# EAGLE schematic BusPirate-ultra.v1.0c (EAGLE 9.1.3)
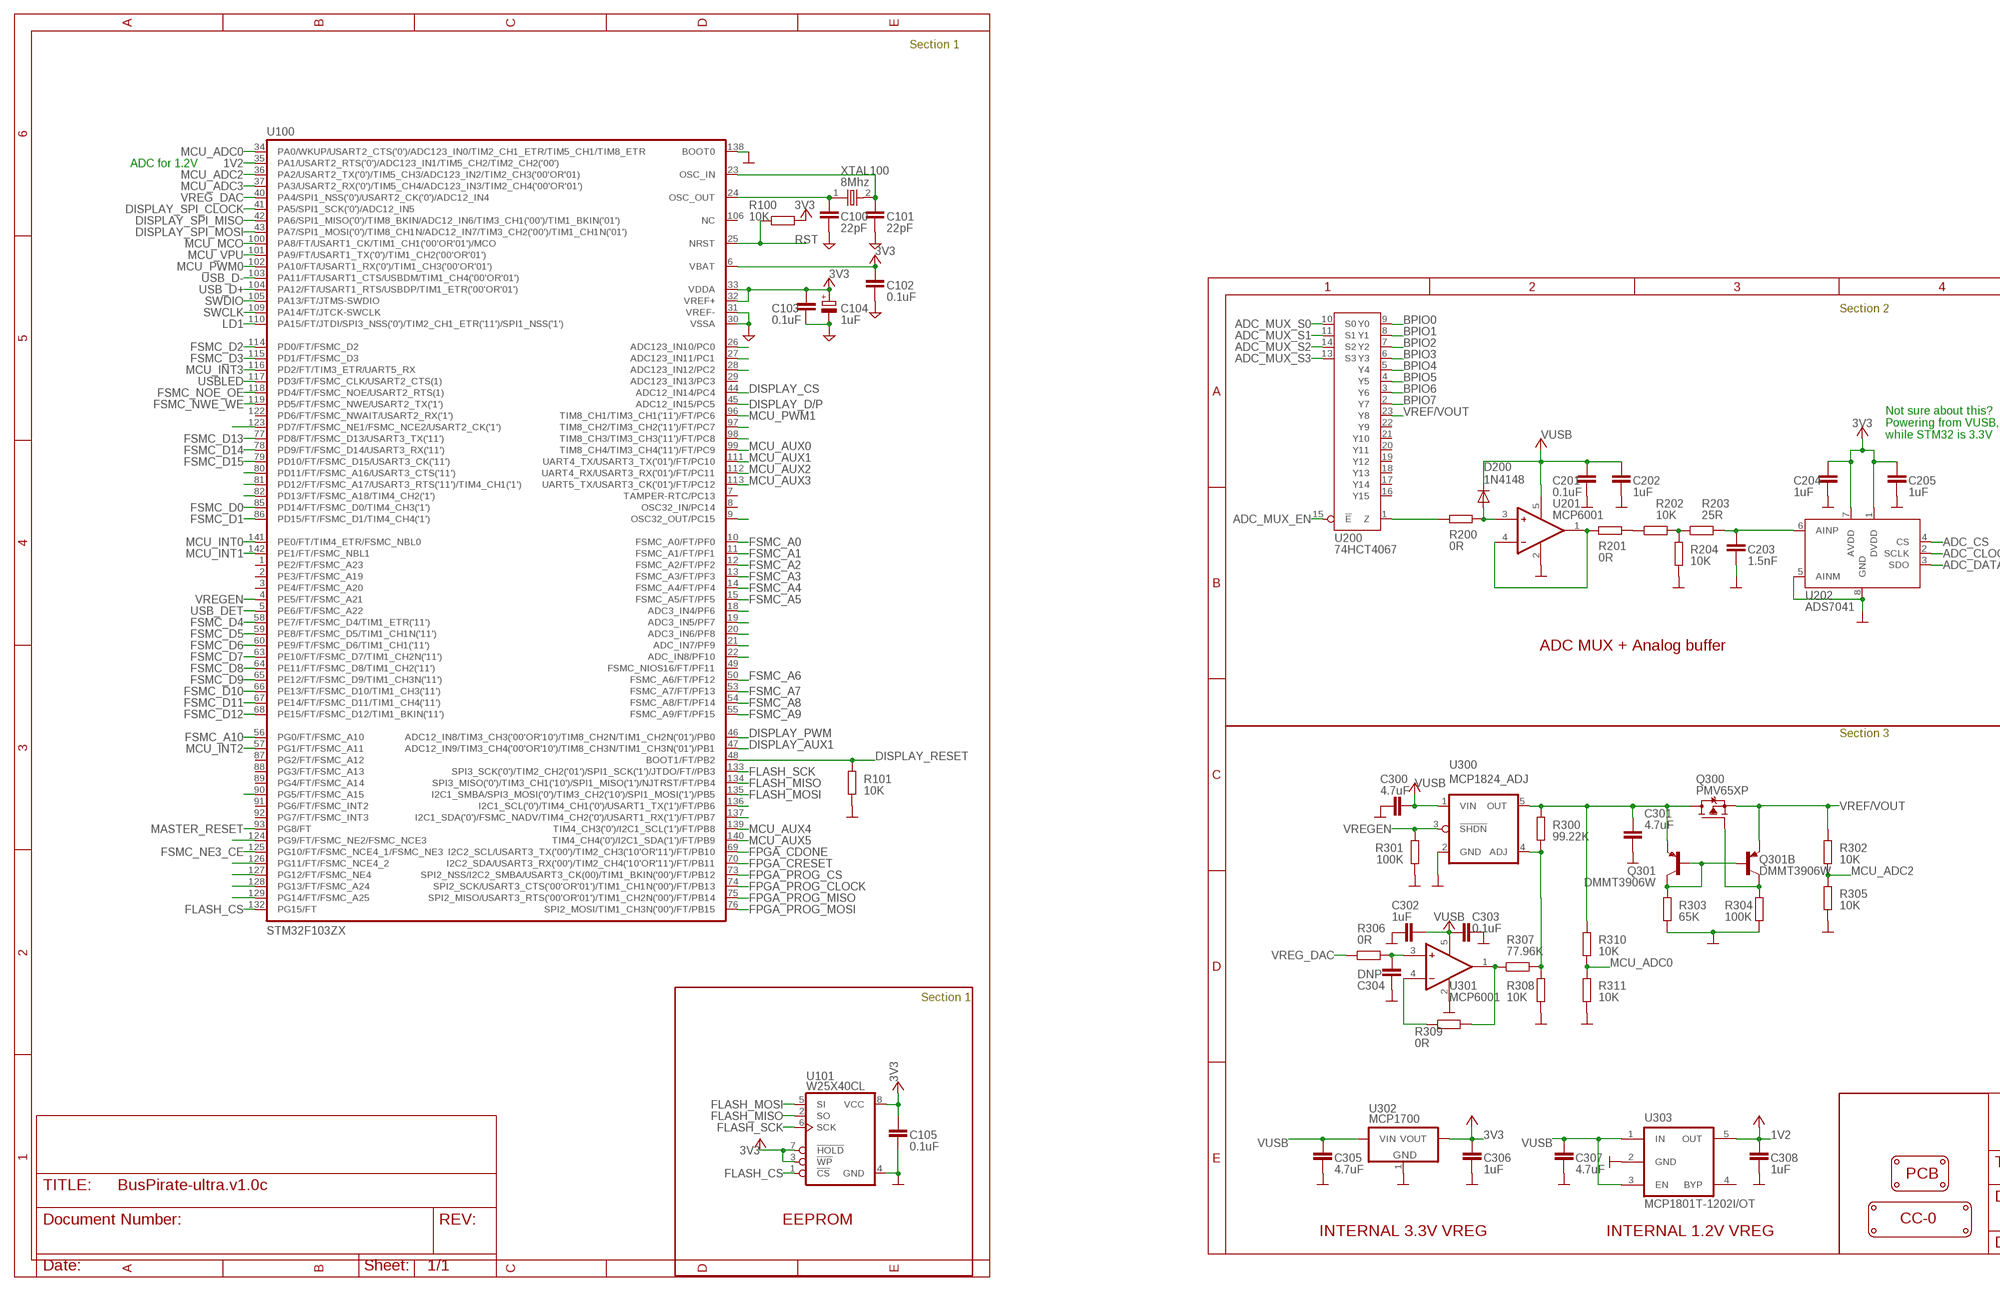
[diagram p0: schematic, sheet 1, part 1 of 3]
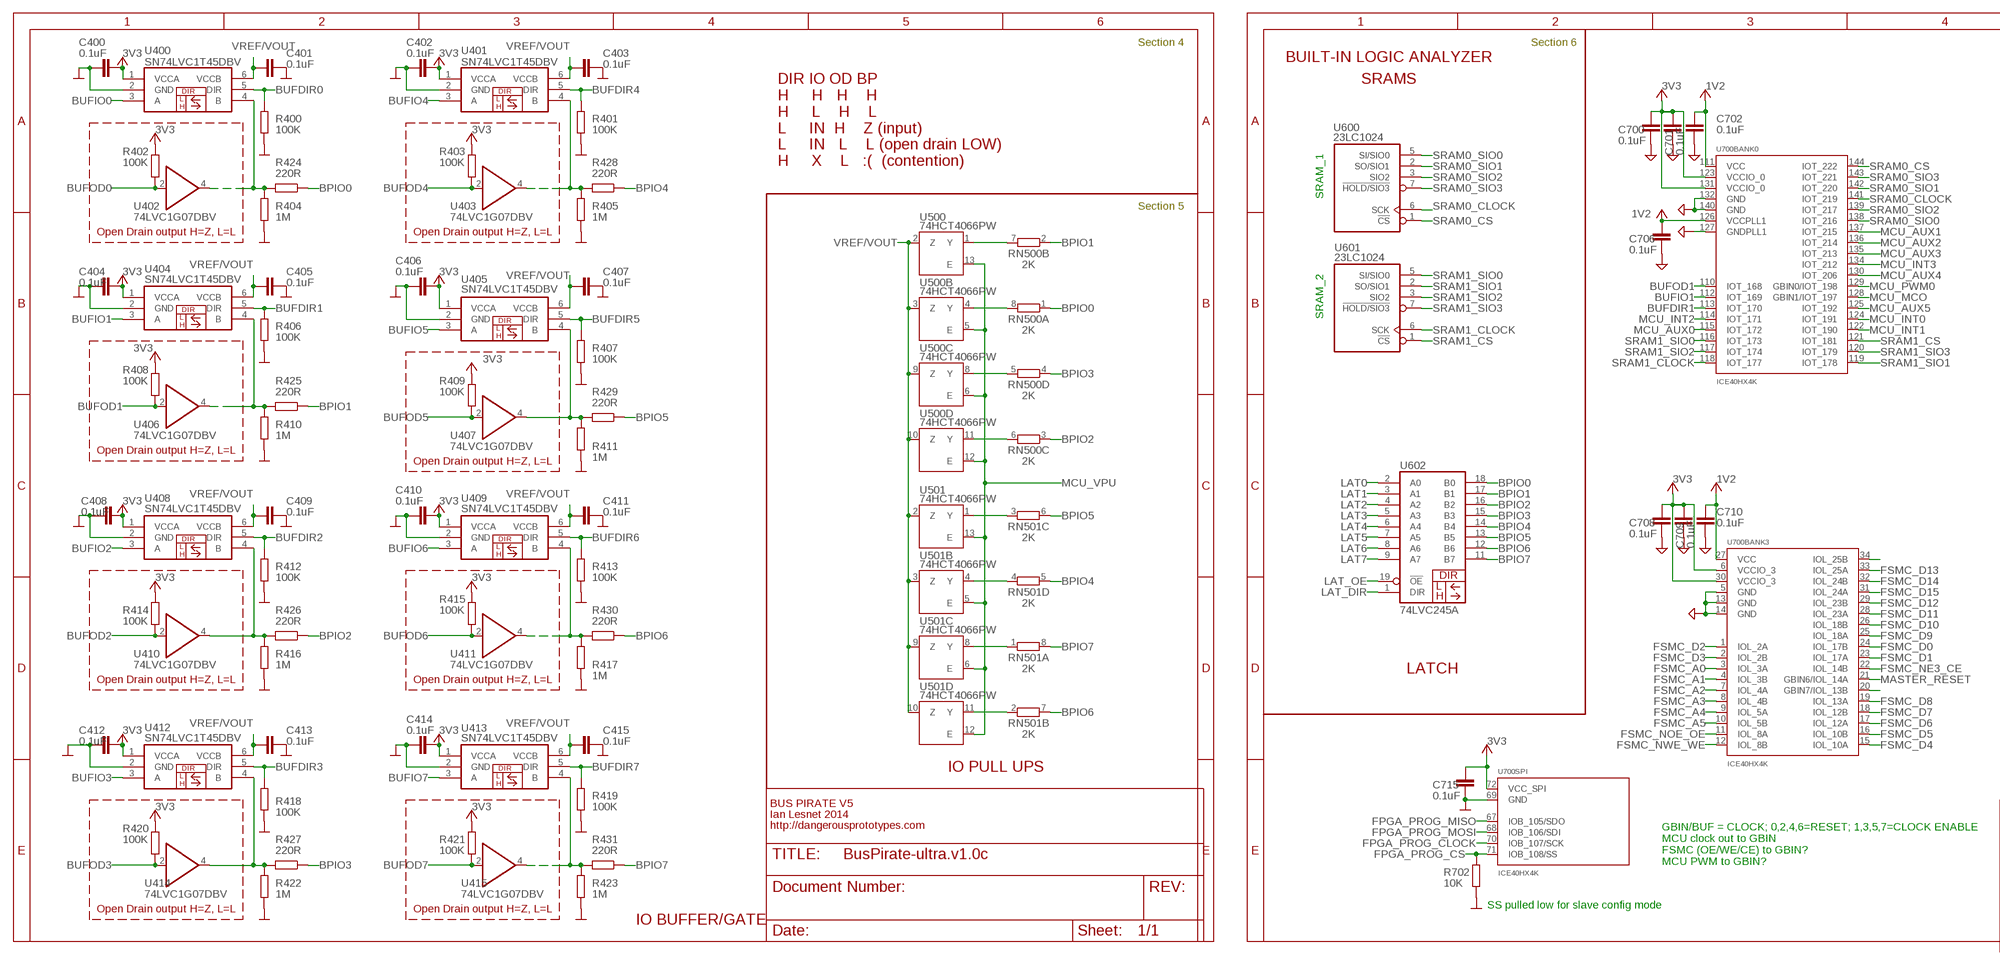
[diagram p1: schematic, sheet 1, part 2 of 3]
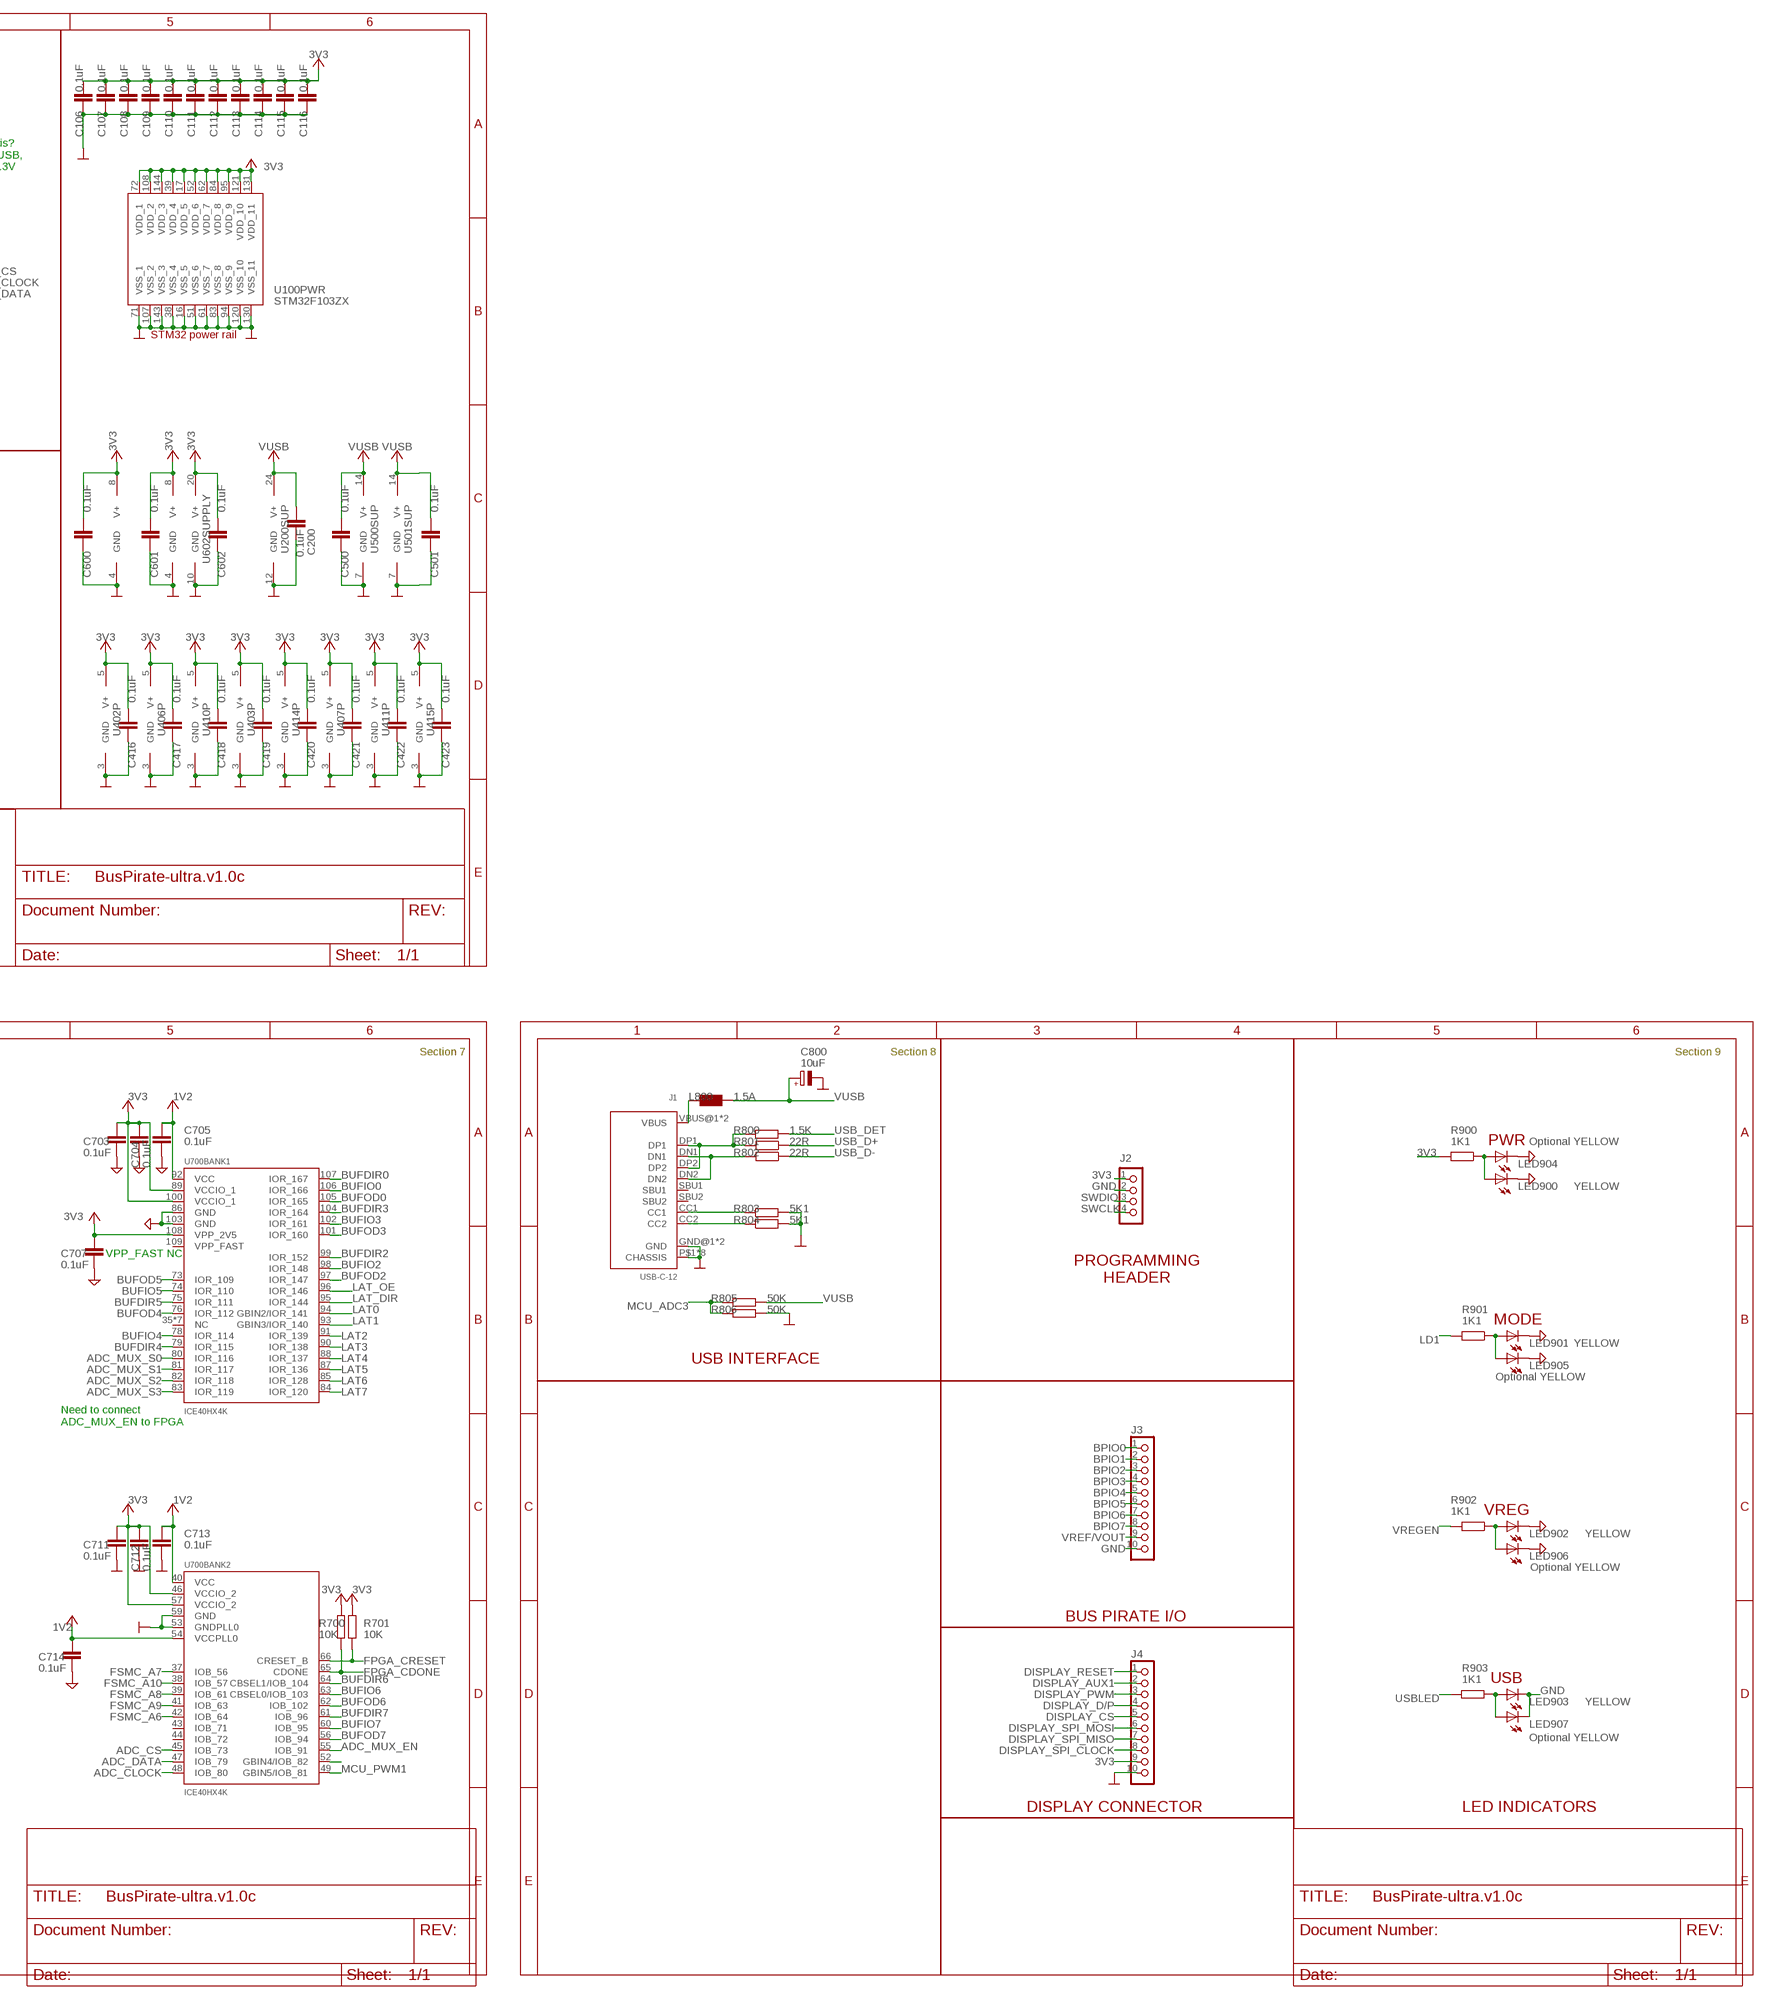
[diagram p2: schematic, sheet 1, part 3 of 3]

## Parts
C100  22pF  CAPACITOR_NPOL-0402  [C402]
C101  22pF  CAPACITOR_NPOL-0402  [C402]
C102  0.1uF  CAPACITOR_NPOL-0402  [C402]
C103  0.1uF  CAPACITOR_NPOL-0402  [C402]
C104  1uF  CAPACITOR_POL-SMC_A  [SMC_A]
C105  0.1uF  CAPACITOR_NPOL-0603  [C603]
C106  0.1uF  CAPACITOR_NPOL-0402  [C402]
C107  0.1uF  CAPACITOR_NPOL-0603  [C603]
C108  0.1uF  CAPACITOR_NPOL-0402  [C402]
C109  0.1uF  CAPACITOR_NPOL-0402  [C402]
C110  0.1uF  CAPACITOR_NPOL-0402  [C402]
C111  0.1uF  CAPACITOR_NPOL-0402  [C402]
C112  0.1uF  CAPACITOR_NPOL-0402  [C402]
C113  0.1uF  CAPACITOR_NPOL-0402  [C402]
C114  0.1uF  CAPACITOR_NPOL-0402  [C402]
C115  0.1uF  CAPACITOR_NPOL-0603  [C603]
C116  0.1uF  CAPACITOR_NPOL-0603  [C603]
C200  0.1uF  CAPACITOR_NPOL-0402  [C402]
C201  0.1uF  CAPACITOR_NPOL-0402  [C402]
C202  1uF  CAPACITOR_NPOL-0402  [C402]
C203  1.5nF  CAPACITOR_NPOL-0402  [C402]
C204  1uF  CAPACITOR_NPOL-0402  [C402]
C205  1uF  CAPACITOR_NPOL-0402  [C402]
C300  4.7uF  CAPACITOR_NPOL-0603  [C603]
C301  4.7uF  CAPACITOR_NPOL-0603  [C603]
C302  1uF  CAPACITOR_NPOL-0402  [C402]
C303  0.1uF  CAPACITOR_NPOL-0402  [C402]
C304  DNP  CAPACITOR_NPOL-0603  [C603]
C305  4.7uF  CAPACITOR_NPOL-0603  [C603]
C306  1uF  CAPACITOR_NPOL-0603  [C603]
C307  4.7uF  CAPACITOR_NPOL-0603  [C603]
C308  1uF  CAPACITOR_NPOL-0402  [C402]
C400  0.1uF  CAPACITOR_NPOL-0402  [C402]
C401  0.1uF  CAPACITOR_NPOL-0402  [C402]
C402  0.1uF  CAPACITOR_NPOL-0402  [C402]
C403  0.1uF  CAPACITOR_NPOL-0402  [C402]
C404  0.1uF  CAPACITOR_NPOL-0402  [C402]
C405  0.1uF  CAPACITOR_NPOL-0402  [C402]
C406  0.1uF  CAPACITOR_NPOL-0402  [C402]
C407  0.1uF  CAPACITOR_NPOL-0402  [C402]
C408  0.1uF  CAPACITOR_NPOL-0402  [C402]
C409  0.1uF  CAPACITOR_NPOL-0402  [C402]
C410  0.1uF  CAPACITOR_NPOL-0402  [C402]
C411  0.1uF  CAPACITOR_NPOL-0402  [C402]
C412  0.1uF  CAPACITOR_NPOL-0402  [C402]
C413  0.1uF  CAPACITOR_NPOL-0402  [C402]
C414  0.1uF  CAPACITOR_NPOL-0402  [C402]
C415  0.1uF  CAPACITOR_NPOL-0402  [C402]
C416  0.1uF  CAPACITOR_NPOL-0402  [C402]
C417  0.1uF  CAPACITOR_NPOL-0402  [C402]
C418  0.1uF  CAPACITOR_NPOL-0402  [C402]
C419  0.1uF  CAPACITOR_NPOL-0402  [C402]
C420  0.1uF  CAPACITOR_NPOL-0402  [C402]
C421  0.1uF  CAPACITOR_NPOL-0402  [C402]
C422  0.1uF  CAPACITOR_NPOL-0402  [C402]
C423  0.1uF  CAPACITOR_NPOL-0402  [C402]
C500  0.1uF  CAPACITOR_NPOL-0603  [C603]
C501  0.1uF  CAPACITOR_NPOL-0402  [C402]
C600  0.1uF  CAPACITOR_NPOL-0603  [C603]
C601  0.1uF  CAPACITOR_NPOL-0603  [C603]
C602  0.1uF  CAPACITOR_NPOL-0402  [C402]
C700  0.1uF  CAPACITOR_NPOL-0603  [C603]
C701  0.1uF  CAPACITOR_NPOL-0603  [C603]
C702  0.1uF  CAPACITOR_NPOL-0402  [C402]
C703  0.1uF  CAPACITOR_NPOL-0402  [C402]
C704  0.1uF  CAPACITOR_NPOL-0402  [C402]
C705  0.1uF  CAPACITOR_NPOL-0402  [C402]
C706  0.1uF  CAPACITOR_NPOL-0603  [C603]
C707  0.1uF  CAPACITOR_NPOL-0402  [C402]
C708  0.1uF  CAPACITOR_NPOL-0402  [C402]
C709  0.1uF  CAPACITOR_NPOL-0402  [C402]
C710  0.1uF  CAPACITOR_NPOL-0402  [C402]
C711  0.1uF  CAPACITOR_NPOL-0402  [C402]
C712  0.1uF  CAPACITOR_NPOL-0402  [C402]
C713  0.1uF  CAPACITOR_NPOL-0402  [C402]
C714  0.1uF  CAPACITOR_NPOL-0402  [C402]
C715  0.1uF  CAPACITOR_NPOL-0402  [C402]
C800  10uF  CAPACITOR_POL-SMC_A  [SMC_A]
D200  1N4148  DIODE-SOD-123  [SOD-123]
J1  USB-C-12  [C-31-M-12]
J2  CON_HEADER_1X04  [M1X4]
J3  CON_HEADER_1X10-RIGHT_ANGLED_PTH_SHROUDED  [M1X10_MALE_RIGHT_ANGLES_PTH_SHROUDED]
J4  CON-FPC_X05B20L10T  [X05B20L10T]
L800  1.5A  WE-KIL_0805  [WE-KI_0805_B]
LED900  YELLOW  LED-0805  [LED-805]
LED901  YELLOW  LED-0805  [LED-805]
LED902  YELLOW  LED-0805  [LED-805]
LED903  YELLOW  LED-0805  [LED-805]
LED904  Optional YELLOW  LED-0805  [LED-805]
LED905  Optional YELLOW  LED-0805  [LED-805]
LED906  Optional YELLOW  LED-0805  [LED-805]
LED907  Optional YELLOW  LED-0805  [LED-805]
LOGO1  LOGO_CC-0  [LOGO_CC-0]
PCB1  PCB_DP_RECTANGLE-50X100  [DP10050_V1]
Q300  PMV65XP  TRANSISTOR_FET_TSM2301CX  [SOT-23]
Q301  DMMT3906W  TRANSISTOR-BJT_DMMT3906W  [SOT-363]
R100  10K  RESISTOR-0402  [R402]
R101  10K  RESISTOR-0402  [R402]
R200  0R  RESISTOR-0402  [R402]
R201  0R  RESISTOR-0402  [R402]
R202  10K  RESISTOR-0402  [R402]
R203  25R  RESISTOR-0402  [R402]
R204  10K  RESISTOR-0402  [R402]
R300  99.22K  RESISTOR-0402  [R402]
R301  100K  RESISTOR-0402  [R402]
R302  10K  RESISTOR-0603  [R603]
R303  65K  RESISTOR-0603  [R603]
R304  100K  RESISTOR-0603  [R603]
R305  10K  RESISTOR-0603  [R603]
R306  0R  RESISTOR-0603  [R603]
R307  77.96K  RESISTOR-0402  [R402]
R308  10K  RESISTOR-0402  [R402]
R309  0R  RESISTOR-0402  [R402]
R310  10K  RESISTOR-0402  [R402]
R311  10K  RESISTOR-0402  [R402]
R400  100K  RESISTOR-0402  [R402]
R401  100K  RESISTOR-0402  [R402]
R402  100K  RESISTOR-0402  [R402]
R403  100K  RESISTOR-0402  [R402]
R404  1M  RESISTOR-0402  [R402]
R405  1M  RESISTOR-0402  [R402]
R406  100K  RESISTOR-0402  [R402]
R407  100K  RESISTOR-0402  [R402]
R408  100K  RESISTOR-0402  [R402]
R409  100K  RESISTOR-0402  [R402]
R410  1M  RESISTOR-0402  [R402]
R411  1M  RESISTOR-0402  [R402]
R412  100K  RESISTOR-0402  [R402]
R413  100K  RESISTOR-0402  [R402]
R414  100K  RESISTOR-0402  [R402]
R415  100K  RESISTOR-0402  [R402]
R416  1M  RESISTOR-0402  [R402]
R417  1M  RESISTOR-0402  [R402]
R418  100K  RESISTOR-0402  [R402]
R419  100K  RESISTOR-0402  [R402]
R420  100K  RESISTOR-0402  [R402]
R421  100K  RESISTOR-0402  [R402]
R422  1M  RESISTOR-0402  [R402]
R423  1M  RESISTOR-0402  [R402]
R424  220R  RESISTOR-0402  [R402]
R425  220R  RESISTOR-0402  [R402]
R426  220R  RESISTOR-0402  [R402]
R427  220R  RESISTOR-0402  [R402]
R428  220R  RESISTOR-0402  [R402]
R429  220R  RESISTOR-0402  [R402]
R430  220R  RESISTOR-0402  [R402]
R431  220R  RESISTOR-0402  [R402]
R700  10K  RESISTOR-0402  [R402]
R701  10K  RESISTOR-0402  [R402]
R702  10K  RESISTOR-0402  [R402]
R800  1.5K  RESISTOR-0402  [R402]
R801  22R  RESISTOR-0402  [R402]
R802  22R  RESISTOR-0402  [R402]
R803  5K1  RESISTOR-0402  [R402]
R804  5K1  RESISTOR-0402  [R402]
R805  50K  RESISTOR-0402  [R402]
R806  50K  RESISTOR-0402  [R402]
R900  1K1  RESISTOR-0603  [R603]
R901  1K1  RESISTOR-0603  [R603]
R902  1K1  RESISTOR-0603  [R603]
R903  1K1  RESISTOR-0603  [R603]
RN500  2K  RNETWORK  [RN8P-4R-CRA06S]
RN501  2K  RNETWORK  [RN8P-4R-CRA06S]
U100  STM32F103ZX  IC_UC_STM32F103ZX  [TQFP-144]
U101  W25X40CL  IC_MEM_W25X40CL  [SOIC-8]
U200  74HCT4067  IC_74HCT4067  [TSSOP-24]
U201  MCP6001  IC_OP-AMP_MCP6001  [SOT-23-5]
U202  ADS7041  IC_ADC_ADS7041  [VSSOP-8_DCU_PDSO_G8]
U300  MCP1824_ADJ  IC_MCP1824_ADJ  [SOT-23-5]
U301  MCP6001  IC_OP-AMP_MCP6001  [SOT-23-5]
U302  MCP1700  IC_MCP1700  [SOT-89]
U303  MCP1801T-1202I/OT  MIC5205  [SOT-23-5@1]
U400  SN74LVC1T45DBV  IC_BUFF_SN74LVC1T45DBV-SC-70-6  [SC-70-6]
U401  SN74LVC1T45DBV  IC_BUFF_SN74LVC1T45DBV-SC-70-6  [SC-70-6]
U402  74LVC1G07DBV  IC_BUFF_74LVC1G07  [SC-70-5]
U403  74LVC1G07DBV  IC_BUFF_74LVC1G07  [SC-70-5]
U404  SN74LVC1T45DBV  IC_BUFF_SN74LVC1T45DBV-SC-70-6  [SC-70-6]
U405  SN74LVC1T45DBV  IC_BUFF_SN74LVC1T45DBV-SC-70-6  [SC-70-6]
U406  74LVC1G07DBV  IC_BUFF_74LVC1G07  [SC-70-5]
U407  74LVC1G07DBV  IC_BUFF_74LVC1G07  [SC-70-5]
U408  SN74LVC1T45DBV  IC_BUFF_SN74LVC1T45DBV-SC-70-6  [SC-70-6]
U409  SN74LVC1T45DBV  IC_BUFF_SN74LVC1T45DBV-SC-70-6  [SC-70-6]
U410  74LVC1G07DBV  IC_BUFF_74LVC1G07  [SC-70-5]
U411  74LVC1G07DBV  IC_BUFF_74LVC1G07  [SC-70-5]
U412  SN74LVC1T45DBV  IC_BUFF_SN74LVC1T45DBV-SC-70-6  [SC-70-6]
U413  SN74LVC1T45DBV  IC_BUFF_SN74LVC1T45DBV-SC-70-6  [SC-70-6]
U414  74LVC1G07DBV  IC_BUFF_74LVC1G07  [SC-70-5]
U415  74LVC1G07DBV  IC_BUFF_74LVC1G07  [SC-70-5]
U500  74HCT4066PW  IC_74HCT4066PW  [TSSOP-14]
U501  74HCT4066PW  IC_74HCT4066PW  [TSSOP-14]
U600  23LC1024  IC_MEM_23LC1024  [SOIC-8]
U601  23LC1024  IC_MEM_23LC1024  [SOIC-8]
U602  74LVC245A  IC_BUFF_74LVC245A-TSSOP20  [TSSOP-20]
U700  ICE40HX4K  IC_FPGA_ICE40HX4K  [TQFP-144]
XTAL100  8Mhz  OSC-XTAL-12M  [XTAL_4X6]

## Nets
1V2 [power]: C308.2 C702.1 C705.1 C706.1 C710.1 C713.1 C714.1 U100.35(PA1/USART2_RTS('0')/ADC123_IN1/TIM5_CH2/TIM2_CH2('00')) U303.5(OUT) U700.27(BANK3:VCC) U700.40(BANK2:VCC) U700.54(BANK2:VCCPLL0) U700.92(BANK1:VCC) U700.111(BANK0:VCC) U700.126(BANK0:VCCPLL1) ; supply symbol labelled SUPPLY_+3V3
3V3 [power]: C102.1 C103.1 C104.+ C105.1 C106.1 C107.1 C108.1 C109.1 C110.1 C111.1 C112.1 C113.1 C114.1 C115.1 C116.1 C204.1 C205.1 C306.2 C400.2 C402.2 C404.2 C406.2 C408.2 C410.2 C412.2 C414.2 C416.2 C417.2 C418.2 C419.2 C420.2 C421.2 C422.2 C423.2 C600.2 C601.2 C602.2 C700.1 C701.1 C703.1 C704.1 C707.1 C708.1 C709.1 C711.1 C712.1 C715.1 J2.1 J4.9 R100.2 R402.2 R403.2 R408.2 R409.2 R414.2 R415.2 R420.2 R421.2 R700.2 R701.2 R900.2 U100.6(VBAT) U100.17(VDD_5) U100.32(VREF+) U100.33(VDDA) U100.39(VDD_4) U100.52(VDD_6) U100.62(VDD_7) U100.72(VDD_1) U100.84(VDD_8) U100.95(VDD_9) U100.108(VDD_2) U100.121(VDD_10) U100.131(VDD_11) U100.144(VDD_3) U101.3(!WP) U101.7(!HOLD) U101.8(VCC) U202.1(DVDD) U202.7(AVDD) U302.3(VOUT) U400.1(VCCA) U401.1(VCCA) U402.5(V+) U403.5(V+) U404.1(VCCA) U405.1(VCCA) U406.5(V+) U407.5(V+) U408.1(VCCA) U409.1(VCCA) U410.5(V+) U411.5(V+) U412.1(VCCA) U413.1(VCCA) U414.5(V+) U415.5(V+) U600.8(V+) U601.8(V+) U602.20(V+) U700.6(BANK3:VCCIO_3) U700.30(BANK3:VCCIO_3) U700.46(BANK2:VCCIO_2) U700.57(BANK2:VCCIO_2) U700.72(SPI:VCC_SPI) U700.89(BANK1:VCCIO_1) U700.100(BANK1:VCCIO_1) U700.108(BANK1:VPP_2V5) U700.123(BANK0:VCCIO_0) U700.131(BANK0:VCCIO_0) ; supply symbol labelled V+, SUPPLY_+3V3, VCC
ADC_CLOCK: U202.2(SCLK) U700.48(BANK2:IOB_80)
ADC_CS: U202.4(CS) U700.45(BANK2:IOB_73)
ADC_DATA: U202.3(SDO) U700.47(BANK2:IOB_79)
ADC_MUX_EN: U200.15(!E) U700.55(BANK2:IOB_91)
ADC_MUX_S0 [signal_digital]: U200.10(S0) U700.80(BANK1:IOR_116)
ADC_MUX_S1 [signal_digital]: U200.11(S1) U700.81(BANK1:IOR_117)
ADC_MUX_S2: U200.14(S2) U700.82(BANK1:IOR_118)
ADC_MUX_S3: U200.13(S3) U700.83(BANK1:IOR_119)
BPIO0: J3.1 R424.1 RN500.1 U200.9(Y0) U602.18(B0)
BPIO0I: R404.2 R424.2 U400.4(B) U402.4(O)
BPIO1: J3.2 R425.1 RN500.2 U200.8(Y1) U602.17(B1)
BPIO1I: R410.2 R425.2 U404.4(B) U406.4(O)
BPIO2: J3.3 R426.1 RN500.3 U200.7(Y2) U602.16(B2)
BPIO2I: R416.2 R426.2 U408.4(B) U410.4(O)
BPIO3: J3.4 R427.1 RN500.4 U200.6(Y3) U602.15(B3)
BPIO3I: R422.2 R427.2 U412.4(B) U414.4(O)
BPIO4: J3.5 R428.1 RN501.5 U200.5(Y4) U602.14(B4)
BPIO4I: R405.2 R428.2 U401.4(B) U403.4(O)
BPIO5 [signal_mixed]: J3.6 R429.1 RN501.6 U200.4(Y5) U602.13(B5)
BPIO5I: R411.2 R429.2 U405.4(B) U407.4(O)
BPIO6 [signal_mixed]: J3.7 R430.1 RN501.7 U200.3(Y6) U602.12(B6)
BPIO6I [signal_mixed]: R417.2 R430.2 U409.4(B) U411.4(O)
BPIO7 [signal_mixed]: J3.8 R431.1 RN501.8 U200.2(Y7) U602.11(B7)
BPIO7I: R423.2 R431.2 U413.4(B) U415.4(O)
BUFDIR0: R400.2 U400.5(DIR) U700.107(BANK1:IOR_167)
BUFDIR1: R406.2 U404.5(DIR) U700.113(BANK0:IOT_170)
BUFDIR2 [signal_digital]: R412.2 U408.5(DIR) U700.99(BANK1:IOR_152)
BUFDIR3: R418.2 U412.5(DIR) U700.104(BANK1:IOR_164)
BUFDIR4 [signal_digital]: R401.2 U401.5(DIR) U700.79(BANK1:IOR_115)
BUFDIR5: R407.2 U405.5(DIR) U700.75(BANK1:IOR_111)
BUFDIR6 [signal_digital]: R413.2 U409.5(DIR) U700.64(BANK2:CBSEL1/IOB_104)
BUFDIR7 [signal_digital]: R419.2 U413.5(DIR) U700.61(BANK2:IOB_96)
BUFIO0: U400.3(A) U700.106(BANK1:IOR_166)
BUFIO1: U404.3(A) U700.112(BANK0:IOT_169)
BUFIO2: U408.3(A) U700.98(BANK1:IOR_148)
BUFIO3: U412.3(A) U700.102(BANK1:IOR_161)
BUFIO4: U401.3(A) U700.78(BANK1:IOR_114)
BUFIO5: U405.3(A) U700.74(BANK1:IOR_110)
BUFIO6 [signal_mixed]: U409.3(A) U700.63(BANK2:CBSEL0/IOB_103)
BUFIO7: U413.3(A) U700.60(BANK2:IOB_95)
BUFOD0: R402.1 U402.2(I) U700.105(BANK1:IOR_165)
BUFOD1: R408.1 U406.2(I) U700.110(BANK0:IOT_168)
BUFOD2: R414.1 U410.2(I) U700.97(BANK1:IOR_147)
BUFOD3: R420.1 U414.2(I) U700.101(BANK1:IOR_160)
BUFOD4: R403.1 U403.2(I) U700.76(BANK1:IOR_112)
BUFOD5: R409.1 U407.2(I) U700.73(BANK1:IOR_109)
BUFOD6 [signal_mixed]: R415.1 U411.2(I) U700.62(BANK2:IOB_102)
BUFOD7: R421.1 U415.2(I) U700.56(BANK2:IOB_94)
D+ [signal_digital]: J1.DP1 J1.DP2 R800.1 R801.2
D- [signal_digital]: J1.DN1 J1.DN2 R802.2
DISPLAY_AUX1 [signal_digital]: J4.2 U100.47(ADC12_IN9/TIM3_CH4('00'OR'10')/TIM8_CH3N/TIM1_CH3N('01')/PB1)
DISPLAY_CS [signal_digital]: J4.5 U100.44(ADC12_IN14/PC4)
DISPLAY_D/P [signal_digital]: J4.4 U100.45(ADC12_IN15/PC5)
DISPLAY_PWM [signal_digital]: J4.3 U100.46(ADC12_IN8/TIM3_CH3('00'OR'10')/TIM8_CH2N/TIM1_CH2N('01')/PB0)
DISPLAY_RESET [signal_digital]: J4.1 R101.2 U100.48(BOOT1/FT/PB2)
DISPLAY_SPI_CLOCK [signal_digital]: J4.8 U100.41(PA5/SPI1_SCK('0')/ADC12_IN5)
DISPLAY_SPI_MISO [signal_digital]: J4.7 U100.42(PA6/SPI1_MISO('0')/TIM8_BKIN/ADC12_IN6/TIM3_CH1('00')/TIM1_BKIN('01'))
DISPLAY_SPI_MOSI [signal_digital]: J4.6 U100.43(PA7/SPI1_MOSI('0')/TIM8_CH1N/ADC12_IN7/TIM3_CH2('00')/TIM1_CH1N('01'))
FLASH_CS: U100.132(PG15/FT) U101.1(!CS)
FLASH_MISO: U100.134(SPI3_MISO('0')/TIM3_CH1('10')/SPI1_MISO('1')/NJTRST/FT/PB4) U101.2(SO)
FLASH_MOSI: U100.135(I2C1_SMBA/SPI3_MOSI('0')/TIM3_CH2('10')/SPI1_MOSI('1')/PB5) U101.5(SI)
FLASH_SCK: U100.133(SPI3_SCK('0')/TIM2_CH2('01')/SPI1_SCK('1')/JTDO/FT//PB3) U101.6(SCK)
FPGA_CDONE: R700.1 U100.69(I2C2_SCL/USART3_TX('00')/TIM2_CH3('10'OR'11')/FT/PB10) U700.65(BANK2:CDONE)
FPGA_CRESET: R701.1 U100.70(I2C2_SDA/USART3_RX('00')/TIM2_CH4('10'OR'11')/FT/PB11) U700.66(BANK2:CRESET_B)
FPGA_PROG_CLOCK: U100.74(SPI2_SCK/USART3_CTS('00'OR'01')/TIM1_CH1N('00')/FT/PB13) U700.70(SPI:IOB_107/SCK)
FPGA_PROG_CS: R702.2 U100.73(SPI2_NSS/I2C2_SMBA/USART3_CK(00)/TIM1_BKIN('00')/FT/PB12) U700.71(SPI:IOB_108/SS)
FPGA_PROG_MISO: U100.75(SPI2_MISO/USART3_RTS('00'OR'01')/TIM1_CH2N('00')/FT/PB14) U700.67(SPI:IOB_105/SDO)
FPGA_PROG_MOSI: U100.76(SPI2_MOSI/TIM1_CH3N('00')/FT/PB15) U700.68(SPI:IOB_106/SDI)
FSMC_A0: U100.10(FSMC_A0/FT/PF0) U700.3(BANK3:IOL_3A)
FSMC_A1: U100.11(FSMC_A1/FT/PF1) U700.4(BANK3:IOL_3B)
FSMC_A2: U100.12(FSMC_A2/FT/PF2) U700.7(BANK3:IOL_4A)
FSMC_A3: U100.13(FSMC_A3/FT/PF3) U700.8(BANK3:IOL_4B)
FSMC_A4: U100.14(FSMC_A4/FT/PF4) U700.9(BANK3:IOL_5A)
FSMC_A5: U100.15(FSMC_A5/FT/PF5) U700.10(BANK3:IOL_5B)
FSMC_A6 [signal_digital]: U100.50(FSMC_A6/FT/PF12) U700.42(BANK2:IOB_64)
FSMC_A7: U100.53(FSMC_A7/FT/PF13) U700.37(BANK2:IOB_56)
FSMC_A8: U100.54(FSMC_A8/FT/PF14) U700.39(BANK2:IOB_61)
FSMC_A9: U100.55(FSMC_A9/FT/PF15) U700.41(BANK2:IOB_63)
FSMC_A10 [signal_digital]: U100.56(PG0/FT/FSMC_A10) U700.38(BANK2:IOB_57)
FSMC_D0: U100.85(PD14/FT/FSMC_D0/TIM4_CH3('1')) U700.24(BANK3:IOL_17B)
FSMC_D1: U100.86(PD15/FT/FSMC_D1/TIM4_CH4('1')) U700.23(BANK3:IOL_17A)
FSMC_D2: U100.114(PD0/FT/FSMC_D2) U700.1(BANK3:IOL_2A)
FSMC_D3: U100.115(PD1/FT/FSMC_D3) U700.2(BANK3:IOL_2B)
FSMC_D4: U100.58(PE7/FT/FSMC_D4/TIM1_ETR('11')) U700.15(BANK3:IOL_10A)
FSMC_D5: U100.59(PE8/FT/FSMC_D5/TIM1_CH1N('11')) U700.16(BANK3:IOL_10B)
FSMC_D6: U100.60(PE9/FT/FSMC_D6/TIM1_CH1('11')) U700.17(BANK3:IOL_12A)
FSMC_D7: U100.63(PE10/FT/FSMC_D7/TIM1_CH2N('11')) U700.18(BANK3:IOL_12B)
FSMC_D8: U100.64(PE11/FT/FSMC_D8/TIM1_CH2('11')) U700.19(BANK3:IOL_13A)
FSMC_D9: U100.65(PE12/FT/FSMC_D9/TIM1_CH3N('11')) U700.25(BANK3:IOL_18A)
FSMC_D10: U100.66(PE13/FT/FSMC_D10/TIM1_CH3('11')) U700.26(BANK3:IOL_18B)
FSMC_D11: U100.67(PE14/FT/FSMC_D11/TIM1_CH4('11')) U700.28(BANK3:IOL_23A)
FSMC_D12: U100.68(PE15/FT/FSMC_D12/TIM1_BKIN('11')) U700.29(BANK3:IOL_23B)
FSMC_D13: U100.77(PD8/FT/FSMC_D13/USART3_TX('11')) U700.33(BANK3:IOL_25A)
FSMC_D14: U100.78(PD9/FT/FSMC_D14/USART3_RX('11')) U700.32(BANK3:IOL_24B)
FSMC_D15: U100.79(PD10/FT/FSMC_D15/USART3_CK('11')) U700.31(BANK3:IOL_24A)
FSMC_NE3_CE: U100.125(PG10/FT/FSMC_NCE4_1/FSMC_NE3) U700.22(BANK3:IOL_14B)
FSMC_NOE_OE: U100.118(PD4/FT/FSMC_NOE/USART2_RTS(1)) U700.11(BANK3:IOL_8A)
FSMC_NWE_WE: U100.119(PD5/FT/FSMC_NWE/USART2_TX('1')) U700.12(BANK3:IOL_8B)
GND: C100.2 C101.2 C102.2 C103.2 C104.- C105.2 C106.2 C107.2 C108.2 C109.2 C110.2 C111.2 C112.2 C113.2 C114.2 C115.2 C116.2 C200.1 C201.2 C202.2 C203.2 C204.2 C205.2 C300.2 C301.2 C302.1 C303.1 C304.1 C305.1 C306.1 C307.1 C308.1 C400.1 C401.2 C402.1 C403.2 C404.1 C405.2 C406.1 C407.2 C408.1 C409.2 C410.1 C411.2 C412.1 C413.2 C414.1 C415.2 C416.1 C417.1 C418.1 C419.1 C420.1 C421.1 C422.1 C423.1 C500.1 C501.1 C600.1 C601.1 C602.1 C700.2 C701.2 C702.2 C703.2 C704.2 C705.2 C706.2 C707.2 C708.2 C709.2 C710.2 C711.2 C712.2 C713.2 C714.2 C715.2 C800.- J1.GND@1(GND) J1.GND@2(GND) J1.P$1(CHASSIS) J1.P$2(CHASSIS) J1.P$3(CHASSIS) J1.P$4(CHASSIS) J1.P$5(CHASSIS) J1.P$6(CHASSIS) J1.P$7(CHASSIS) J1.P$8(CHASSIS) J2.2 J3.10 J4.10 LED900.C LED901.C LED902.C LED903.C LED904.C LED905.C LED906.C LED907.C R101.1 R204.2 R301.2 R303.1 R304.1 R305.2 R308.2 R311.2 R400.1 R401.1 R404.1 R405.1 R406.1 R407.1 R410.1 R411.1 R412.1 R413.1 R416.1 R417.1 R418.1 R419.1 R422.1 R423.1 R702.1 R803.2 R804.2 R806.1 U100.16(VSS_5) U100.30(VSSA) U100.31(VREF-) U100.38(VSS_4) U100.51(VSS_6) U100.61(VSS_7) U100.71(VSS_1) U100.83(VSS_8) U100.94(VSS_9) U100.107(VSS_2) U100.120(VSS_10) U100.130(VSS_11) U100.138(BOOT0) U100.143(VSS_3) U101.4(GND) U200.12(GND) U201.2(V-) U202.5(AINM) U202.8(GND) U300.2(GND) U301.2(V-) U302.1(GND) U303.2(GND) U400.2(GND) U401.2(GND) U402.3(GND) U403.3(GND) U404.2(GND) U405.2(GND) U406.3(GND) U407.3(GND) U408.2(GND) U409.2(GND) U410.3(GND) U411.3(GND) U412.2(GND) U413.2(GND) U414.3(GND) U415.3(GND) U500.7(GND) U501.7(GND) U600.4(GND) U601.4(GND) U602.10(GND) U700.5(BANK3:GND) U700.13(BANK3:GND) U700.14(BANK3:GND) U700.53(BANK2:GNDPLL0) U700.59(BANK2:GND) U700.69(SPI:GND) U700.86(BANK1:GND) U700.103(BANK1:GND) U700.127(BANK0:GNDPLL1) U700.132(BANK0:GND) U700.140(BANK0:GND) ; supply symbol labelled SUPPLY_GND
LAT0: U602.2(A0) U700.94(BANK1:GBIN2/IOR_141)
LAT1: U602.3(A1) U700.93(BANK1:GBIN3/IOR_140)
LAT2: U602.4(A2) U700.91(BANK1:IOR_139)
LAT3: U602.5(A3) U700.90(BANK1:IOR_138)
LAT4: U602.6(A4) U700.88(BANK1:IOR_137)
LAT5: U602.7(A5) U700.87(BANK1:IOR_136)
LAT6: U602.8(A6) U700.85(BANK1:IOR_128)
LAT7: U602.9(A7) U700.84(BANK1:IOR_120)
LAT_DIR: U602.1(DIR) U700.95(BANK1:IOR_144)
LAT_OE: U602.19(!OE) U700.96(BANK1:IOR_146)
LD1: R901.2 U100.110(PA15/FT/JTDI/SPI3_NSS('0')/TIM2_CH1_ETR('11')/SPI1_NSS('1'))
MASTER_RESET: U100.93(PG8/FT) U700.21(BANK3:GBIN6/IOL_14A)
MCU_ADC0: R310.2 R311.1 U100.34(PA0/WKUP/USART2_CTS('0')/ADC123_IN0/TIM2_CH1_ETR/TIM5_CH1/TIM8_ETR)
MCU_ADC2: R302.2 R305.1 U100.36(PA2/USART2_TX('0')/TIM5_CH3/ADC123_IN2/TIM2_CH3('00'OR'01))
MCU_ADC3: R805.2 R806.2 U100.37(PA3/USART2_RX('0')/TIM5_CH4/ADC123_IN3/TIM2_CH4('00'OR'01'))
MCU_AUX0: U100.99(TIM8_CH4/TIM3_CH4('11')/FT/PC9) U700.115(BANK0:IOT_172)
MCU_AUX1: U100.111(UART4_TX/USART3_TX('01')/FT/PC10) U700.137(BANK0:IOT_215)
MCU_AUX2: U100.112(UART4_RX/USART3_RX('01')/FT/PC11) U700.136(BANK0:IOT_214)
MCU_AUX3: U100.113(UART5_TX/USART3_CK('01')/FT/PC12) U700.135(BANK0:IOT_213)
MCU_AUX4: U100.139(TIM4_CH3('0')/I2C1_SCL('1')/FT/PB8) U700.130(BANK0:IOT_206)
MCU_AUX5: U100.140(TIM4_CH4('0')/I2C1_SDA('1')/FT/PB9) U700.125(BANK0:IOT_192)
MCU_INT0: U100.141(PE0/FT/TIM4_ETR/FSMC_NBL0) U700.124(BANK0:IOT_191)
MCU_INT1: U100.142(PE1/FT/FSMC_NBL1) U700.122(BANK0:IOT_190)
MCU_INT2: U100.57(PG1/FT/FSMC_A11) U700.114(BANK0:IOT_171)
MCU_INT3: U100.116(PD2/FT/TIM3_ETR/UART5_RX) U700.134(BANK0:IOT_212)
MCU_MCO: U100.100(PA8/FT/USART1_CK/TIM1_CH1('00'OR'01')/MCO) U700.128(BANK0:GBIN1/IOT_197)
MCU_PWM0: U100.102(PA10/FT/USART1_RX('0')/TIM1_CH3('00'OR'01')) U700.129(BANK0:GBIN0/IOT_198)
MCU_PWM1: U100.96(TIM8_CH1/TIM3_CH1('11')/FT/PC6) U700.49(BANK2:GBIN5/IOB_81)
MCU_VPU [signal_digital]: U100.101(PA9/FT/USART1_TX('0')/TIM1_CH2('00'OR'01')) U500.5(E) U500.6(E) U500.12(E) U500.13(E) U501.5(E) U501.6(E) U501.12(E) U501.13(E)
N$1: J1.VBUS@1(VBUS) J1.VBUS@2(VBUS) L800.2
N$2: RN500.7 U500.1(Y)
N$3: RN500.8 U500.4(Y)
N$4: RN500.5 U500.8(Y)
N$5: RN500.6 U500.11(Y)
N$6: LED901.A LED905.A R901.1
N$7: LED900.A LED904.A R900.1
N$8: C101.1 U100.23(OSC_IN) XTAL100.2
N$9: C100.1 U100.24(OSC_OUT) XTAL100.1
N$11: Q300.1(G) Q301.6(C) R304.2
N$12: R300.1 R307.2 R308.1 U300.4(ADJ)
N$13: LED903.A LED907.A R903.1
N$14: J1.CC1 R803.1
N$15: R309.1 U301.4(-)
N$16: U100.9(OSC32_OUT/PC15)
N$17: U700.34(BANK3:IOL_25B)
N$18: LED902.A LED906.A R902.1
N$19: U100.97(TIM8_CH2/TIM3_CH2('11')/FT/PC7)
N$20: J1.CC2 R804.1
N$21: R201.2 R202.1
N$22: U100.98(TIM8_CH3/TIM3_CH3('11')/FT/PC8)
N$23: U100.28(ADC123_IN12/PC2)
N$24: R202.2 R203.1 R204.1
N$25: R307.1 R309.2 U301.1(OUT)
N$26 [power]: C301.1 Q300.3(D) Q301.4(E) R300.2 R310.1 U300.5(OUT)
N$27: Q301.1(B) Q301.2(B) Q301.3(C) R303.2
N$28: U100.80(PD11/FT/FSMC_A16/USART3_CTS('11'))
N$30: U100.26(ADC123_IN10/PC0)
N$31: C304.2 R306.2 U301.3(+)
N$32 [signal_analog]: D200.A R200.2 U201.3(+)
N$33: RN501.3 U501.1(Y)
N$34: U100.82(PD13/FT/FSMC_A18/TIM4_CH2('1'))
N$35: U100.27(ADC123_IN11/PC1)
N$36: U100.18(ADC3_IN4/PF6)
N$37: U100.19(ADC3_IN5/PF7)
N$38: U100.20(ADC3_IN6/PF8)
N$39: U100.21(ADC_IN7/PF9)
N$40: U100.22(ADC_IN8/PF10)
N$42: RN501.4 U501.4(Y)
N$43: U100.81(PD12/FT/FSMC_A17/USART3_RTS('11')/TIM4_CH1('1'))
N$44: RN501.1 U501.8(Y)
N$45: RN501.2 U501.11(Y)
N$46: C203.1 R203.2 U202.6(AINP)
N$47 [signal_analog]: R200.1 U200.1(Z)
N$48: U100.136(I2C1_SCL('0')/TIM4_CH1('0')/USART1_TX('1')/FT/PB6)
N$49: U100.137(I2C1_SDA('0')/FSMC_NADV/TIM4_CH2('0')/USART1_RX('1')/FT/PB7)
N$50: U700.20(BANK3:GBIN7/IOL_13B)
N$51: U700.52(BANK2:GBIN4/IOB_82)
N$52: U100.90(PG5/FT/FSMC_A15)
N$54: U100.124(PG9/FT/FSMC_NE2/FSMC_NCE3)
N$56: U100.123(PD7/FT/FSMC_NE1/FSMC_NCE2/USART2_CK('1'))
N$57: U100.126(PG11/FT/FSMC_NCE4_2)
N$58: U100.127(PG12/FT/FSMC_NE4)
N$59: U100.128(PG13/FT/FSMC_A24)
N$60: U100.129(PG14/FT/FSMC_A25)
N$64: R201.1 U201.1(OUT) U201.4(-)
RST: R100.1 U100.25(NRST)
SRAM0_CLOCK: U600.6(SCK) U700.141(BANK0:IOT_219)
SRAM0_CS: U600.1(!CS) U700.144(BANK0:IOT_222)
SRAM0_SIO0: U600.5(SI/SIO0) U700.138(BANK0:IOT_216)
SRAM0_SIO1: U600.2(SO/SIO1) U700.142(BANK0:IOT_220)
SRAM0_SIO2: U600.3(SIO2) U700.139(BANK0:IOT_217)
SRAM0_SIO3: U600.7(!HOLD/SIO3) U700.143(BANK0:IOT_221)
SRAM1_CLOCK: U601.6(SCK) U700.118(BANK0:IOT_177)
SRAM1_CS: U601.1(!CS) U700.121(BANK0:IOT_181)
SRAM1_SIO0: U601.5(SI/SIO0) U700.116(BANK0:IOT_173)
SRAM1_SIO1: U601.2(SO/SIO1) U700.119(BANK0:IOT_178)
SRAM1_SIO2: U601.3(SIO2) U700.117(BANK0:IOT_174)
SRAM1_SIO3: U601.7(!HOLD/SIO3) U700.120(BANK0:IOT_179)
SWCLK: J2.4 U100.109(PA14/FT/JTCK-SWCLK)
SWDIO: J2.3 U100.105(PA13/FT/JTMS-SWDIO)
USB_D+: R801.1 U100.104(PA12/FT/USART1_RTS/USBDP/TIM1_ETR('00'OR'01'))
USB_D-: R802.1 U100.103(PA11/FT/USART1_CTS/USBDM/TIM1_CH4('00'OR'01'))
USB_DET: R800.2 U100.5(PE6/FT/FSMC_A22)
USBLED: R903.2 U100.117(PD3/FT/FSMC_CLK/USART2_CTS(1))
VREF/VOUT [power]: C401.1 C403.1 C405.1 C407.1 C409.1 C411.1 C413.1 C415.1 J3.9 Q300.2(S) Q301.5(E) R302.1 U200.23(Y8) U400.6(VCCB) U401.6(VCCB) U404.6(VCCB) U405.6(VCCB) U408.6(VCCB) U409.6(VCCB) U412.6(VCCB) U413.6(VCCB) U500.2(Z) U500.3(Z) U500.9(Z) U500.10(Z) U501.2(Z) U501.3(Z) U501.9(Z) U501.10(Z)
VREG_DAC: R306.1 U100.40(PA4/SPI1_NSS('0')/USART2_CK('0')/ADC12_IN4)
VREGEN: R301.1 R902.2 U100.4(PE5/FT/FSMC_A21) U300.3(!SHDN)
VUSB [power]: C200.2 C201.1 C202.1 C300.1 C302.2 C303.2 C305.2 C307.2 C500.2 C501.2 C800.+ D200.C L800.1 R805.1 U200.24(V+) U201.5(V+) U300.1(VIN) U301.5(V+) U302.2(VIN) U303.1(IN) U303.3(EN) U500.14(V+) U501.14(V+) ; supply symbol labelled V+
Unconnected: J1.SBU1 J1.SBU2 U100.1(PE2/FT/FSMC_A23) U100.2(PE3/FT/FSMC_A19) U100.3(PE4/FT/FSMC_A20) U100.7(TAMPER-RTC/PC13) U100.8(OSC32_IN/PC14) U100.29(ADC123_IN13/PC3) U100.49(FSMC_NIOS16/FT/PF11) U100.87(PG2/FT/FSMC_A12) U100.88(PG3/FT/FSMC_A13) U100.89(PG4/FT/FSMC_A14) U100.91(PG6/FT/FSMC_INT2) U100.92(PG7/FT/FSMC_INT3) U100.106(NC) U100.122(PD6/FT/FSMC_NWAIT/USART2_RX('1')) U200.16(Y15) U200.17(Y14) U200.18(Y13) U200.19(Y12) U200.20(Y11) U200.21(Y10) U200.22(Y9) U303.4(BYP) U700.35(BANK1:NC) U700.36(BANK1:NC) U700.43(BANK2:IOB_71) U700.44(BANK2:IOB_72) U700.50(BANK1:NC) U700.51(BANK1:NC) U700.58(BANK1:NC) U700.77(BANK1:NC) U700.133(BANK1:NC)

## Notes on the sheet
- Section 1
- ADC for 1.2V
- Section 2
- Not sure about this?
  Powering from VUSB,
  while STM32 is 3.3V
- STM32 power rail
- ADC MUX + Analog buffer
- Section 3
- Section 1
- EEPROM
- INTERNAL 3.3V VREG | INTERNAL 1.2V VREG
- Section 4 | Section 6 | Section 7 | Section 8 | Section 9
- BUILT-IN LOGIC ANALYZER
- SRAMS
- PWR
- DIR IO OD BP
  H     H   H    H
  H     L    H    L
  L     IN  H    Z (input)
  L     IN   L    L (open drain LOW)
  H     X    L   :(  (contention)
- SRAM_1
- Section 5
- Open Drain output H=Z, L=L | Open Drain output H=Z, L=L
- VPP_FAST NC
- PROGRAMMING
  HEADER
- MODE
- SRAM_2
- USB INTERFACE
- Need to connect
  ADC_MUX_EN to FPGA
- Open Drain output H=Z, L=L
- Open Drain output H=Z, L=L
- VREG
- BUS PIRATE I/O
- USB
- LATCH
- Open Drain output H=Z, L=L | Open Drain output H=Z, L=L
- IO PULL UPS
- DISPLAY CONNECTOR | LED INDICATORS
- BUS PIRATE V5
- Ian Lesnet 2014
- http://dangerousprototypes.com
- GBIN/BUF = CLOCK; 0,2,4,6=RESET; 1,3,5,7=CLOCK ENABLE
  MCU clock out to GBIN
  FSMC (OE/WE/CE) to GBIN?
  MCU PWM to GBIN?
- Open Drain output H=Z, L=L | Open Drain output H=Z, L=L | SS pulled low for slave config mode
- IO BUFFER/GATE

## Power pins joined to a net without a drawn wire
VPP_FAST: U700.109(BANK1:VPP_FAST)

## Library data of the parts
C100-C103 C105-C116 C200-C205 C300-C308 C400-C423 C500 C501 C600-C602 C700-C715 = dp_devices.v6:CAPACITOR_NPOL: Non-Polarized capacitor in various packages
C104 C800 = dp_devices.v6:CAPACITOR_POL: Polarized capacitor in various packages
D200 = dp_devices.v6:DIODE: Various Diode Packages
J1 = usbc:USB-C-12
J2 = dp_devices.v6:CON_HEADER_1X04
J3 = dp_devices.v6:CON_HEADER_1X10
J4 = dp_devices.v6:CON-FPC_X05B20L10T: 10-pin 0.5mm pitch SMD FPC Connector X05B20L10T
L800 = wuerth-elektronik:WE-KIL: SMD Wire Wound Ceramic Inductor WE-KIL - Low profile - High Q values -- Bluetooth -- Wireless LAN -- RF oscillation circuit -- IF impedance matching
LED900-LED907 = dp_devices.v6:LED: Light Emitting Diode
LOGO1 = dp_devices:LOGO_CC-0
PCB1 = dp_blank_pcb:PCB_DP_RECTANGLE: Dangerous Prototypes Standard Rectangular PCB sizes
Q300 = dp_devices.v6:TRANSISTOR_FET_TSM2301CX: 20V P-Channel Enhancement Mode MOSFET
Q301 = dp_devices.v6:TRANSISTOR-BJT_DMMT3906W: Matched pair PNP small signal transistor -40V -200mA
R100 R101 R200-R204 R300-R311 R400-R431 R700-R702 R800-R806 R900-R903 = dp_devices.v6:RESISTOR
RN500 RN501 = dp_devices:RNETWORK: 4 Resistor Array 0603
U100 = dp_devices.v6:IC_UC_STM32F103ZX: STM32F103ZX High-density performance line ARM based 32-bit MCU
U101 = dp_devices.v6:IC_MEM_W25X40CL: 4M-Bit serial flash memory with 4KB sectors and Dual I/O SPI
U200 = dp_devices.v6:IC_74HCT4067: 74HCT4067 16-channel analog multiplexer/demultiplexer
U201 U301 = dp_devices.v6:IC_OP-AMP_MCP6001: 1 MHz, Low-Power Op Amp
U202 = dp_devices.v6:IC_ADC_ADS7041: Ultra-low power 10-Bit 1-MSPS SAR ADC
U300 = dp_devices.v6:IC_MCP1824_ADJ: MCP1824 ADJ 300mA, Low voltage, Low Quiescent current adjustable LDO regulator
U302 = dp_devices.v6:IC_MCP1700: Low quiescent current LDO 200~250mA Output current
U303 = dp_devices:MIC5205: 150ma Low-Noise LDO Regulator
U400 U401 U404 U405 U408 U409 U412 U413 = dp_devices.v6:IC_BUFF_SN74LVC1T45DBV
U402 U403 U406 U407 U410 U411 U414 U415 = dp_devices.v6:IC_BUFF_74LVC1G07: Single buffer/driver with open drain output
U500 U501 = dp_devices.v6:IC_74HCT4066PW: Quad single-pole single-throw analog switch
U600 U601 = dp_devices:IC_MEM_23LC1024: 1Mbit SPI SRAM with Serial dual interface and Serial quad interface
U602 = dp_devices.v6:IC_BUFF_74LVC245A: Octal Bus transceiver with 3-state, 3.3V supply
U700 = dp_devices.v6:IC_FPGA_ICE40HX4K: iCE40HX4K iCE40™ HX ultra-low power, non-volatile FPGA
XTAL100 = dp_devices.v6:OSC-XTAL

## Net classes
1 power: width 0.305 mm
2 signal_analog: width 0.254 mm
3 signal_digital: width 0.254 mm
4 signal_mixed: width 0.254 mm